# Altium project Nova_34.PrjPcb
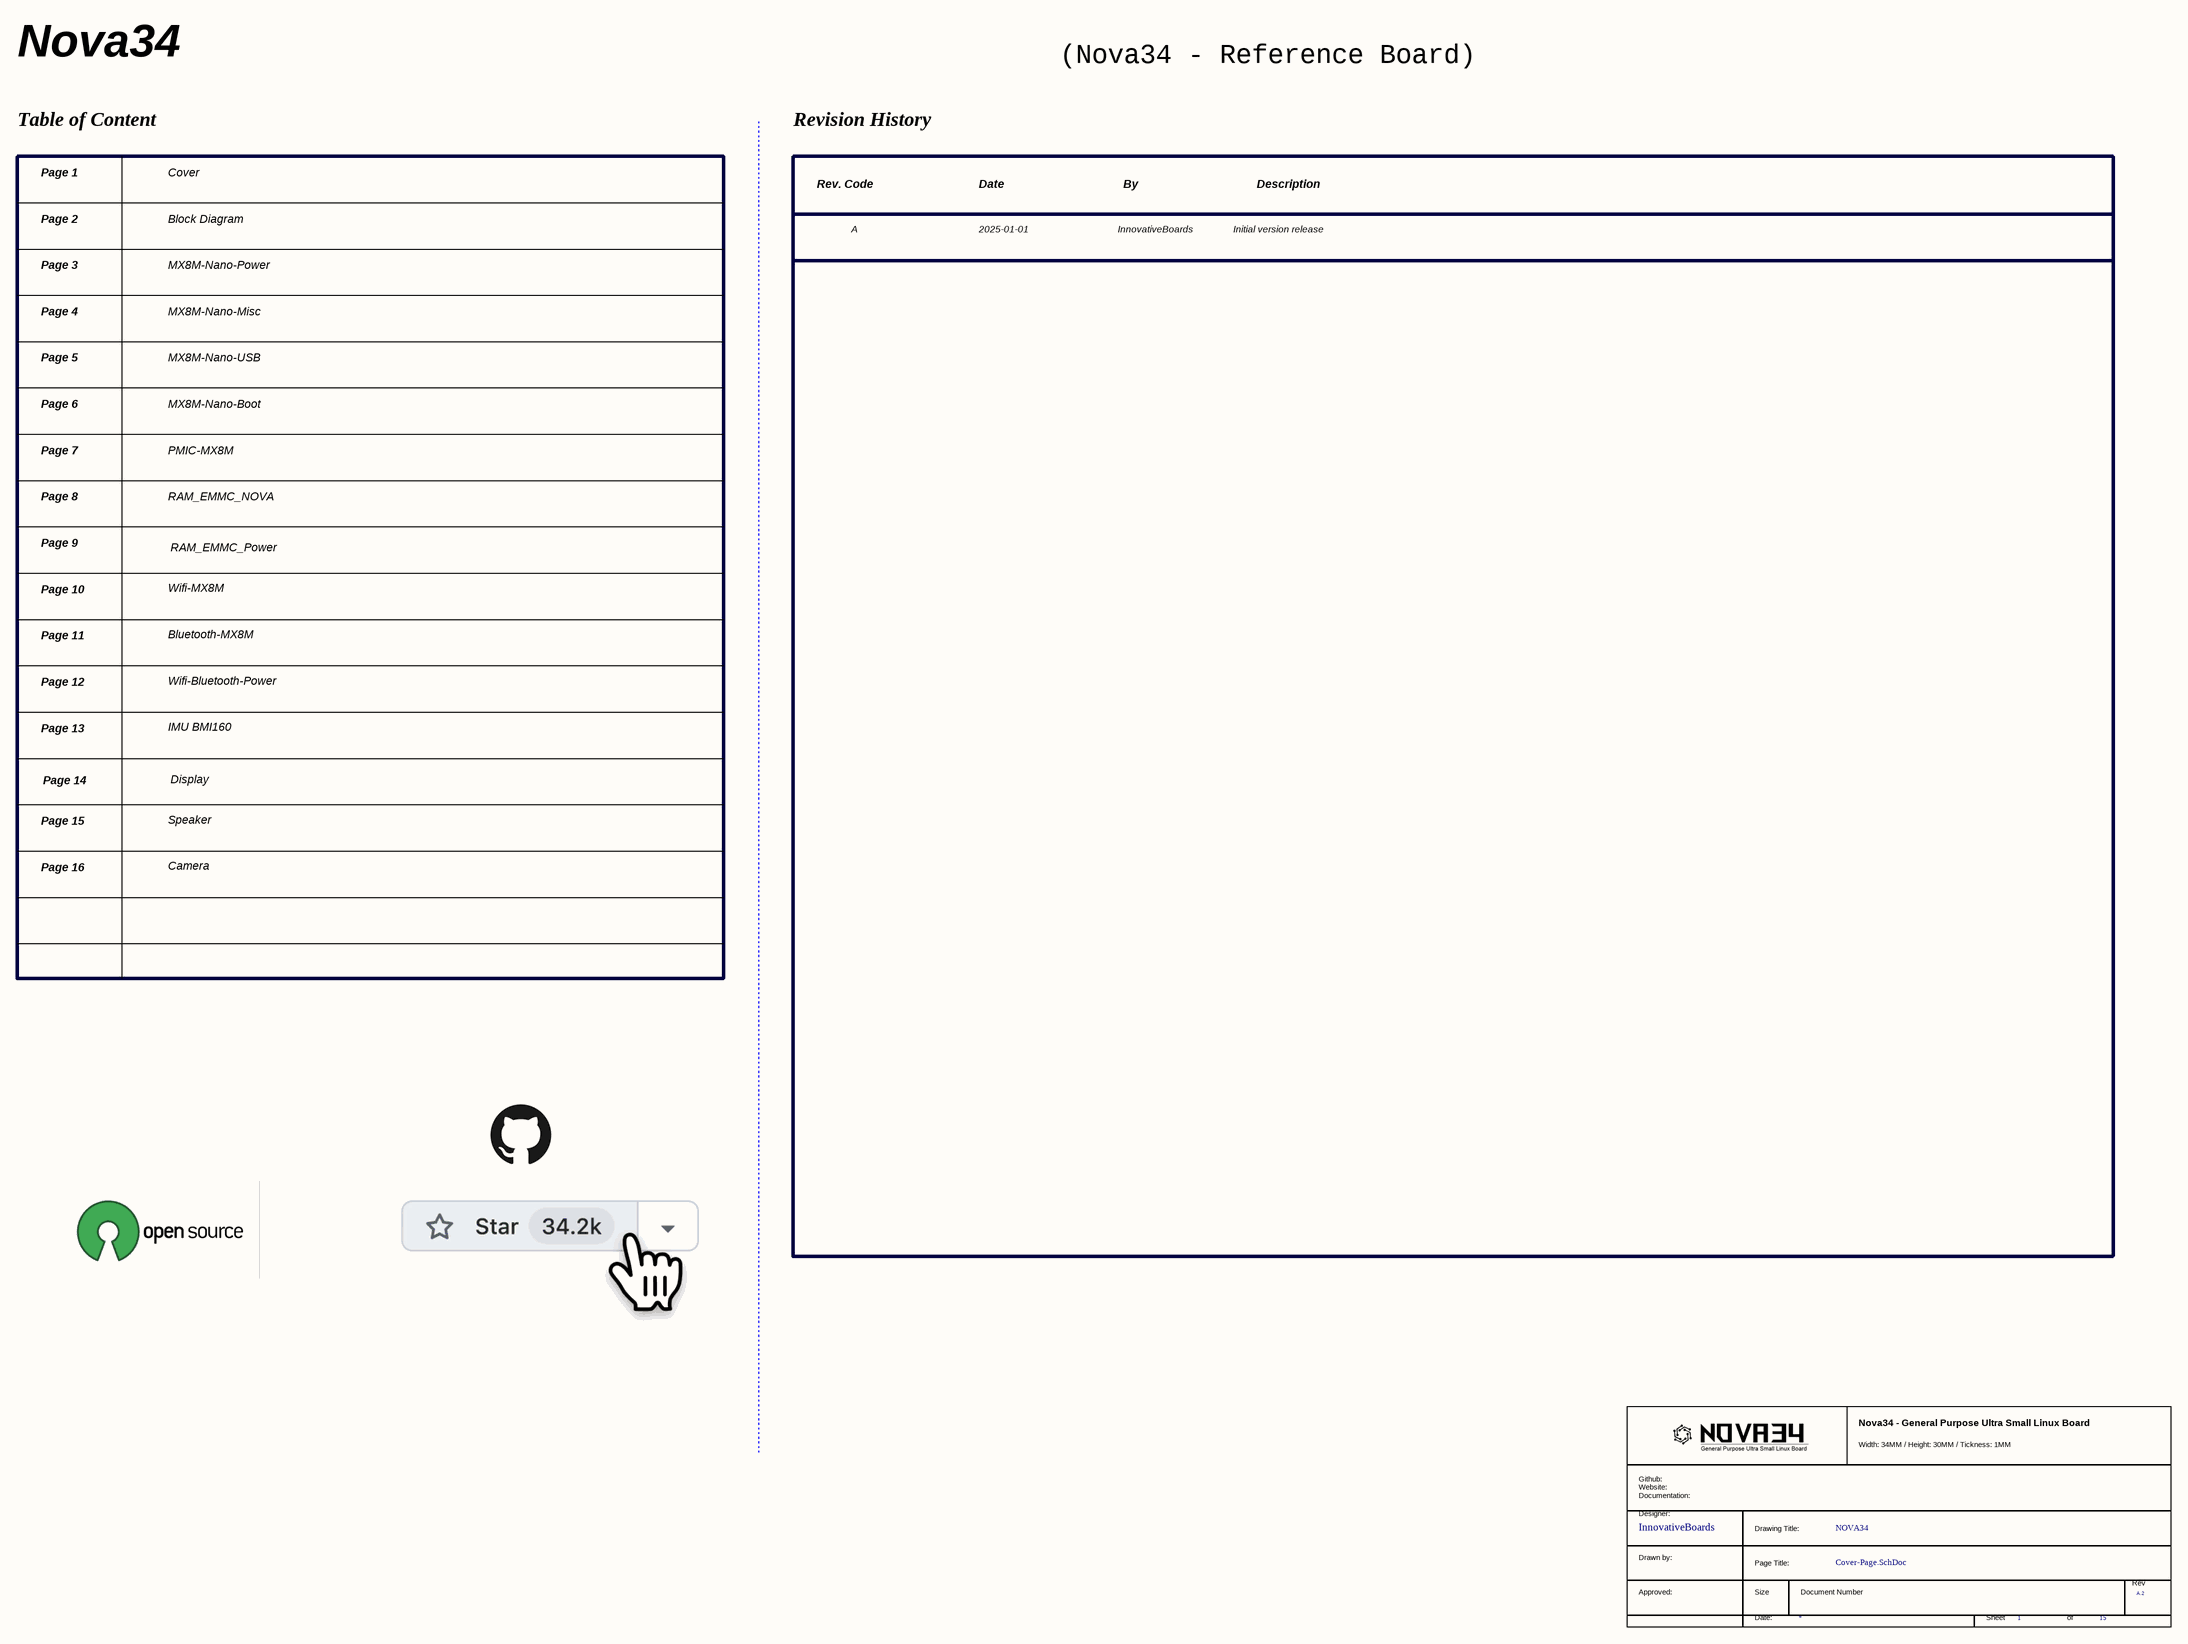
[diagram p0: Cover-Page.SchDoc]
8 sheets, 58 parts. Net scope: global (net labels, ports and power ports of the same name join across sheets).
Board file: Nova_PCB_Prod.PcbDoc
Sheets:
  Cover-Page.SchDoc
  NOVA-Block.SchDoc
    U_IMU-BMI160 = IMU-BMI160.SchDoc
    U_Display-ST0103A2W-WSNLW-F = Display-ST0103A2W-WSNLW-F.SchDoc
    U_Speaker = Speaker.SchDoc
    U_Bluetooth-MX8M = Bluetooth-MX8M.SchDoc
    U_Camera = Camera.SchDoc
    U_RAM_EMMC_Power = RAM_EMMC_Power.SchDoc

## Sheet Cover-Page.SchDoc
size C; SheetNumber: 1; SheetTotal: 15

### Parts
(Parts that share a designator on the sheet are numbered #1, #2 ... from top to bottom, then left to right.)
*#1  RevCode: A.2  (hidden comment: TitleBlock_MCPG)  (graphical)

### Notes on the sheet
- Nova34
- (Nova34 - Reference Board)
- Table of Content
- Page 1
- Cover
- Revision History
- Page 2
- Block Diagram
- Rev. Code
- A
- Date
- 2025-01-01
- InnovativeBoards
- By
- Initial version release
- Description
- Page 3
- MX8M-Nano-Power
- Page 4
- MX8M-Nano-Misc
- Page 5
- Page 6
- MX8M-Nano-USB
- MX8M-Nano-Boot
- Page 7
- PMIC-MX8M
- Page 8
- RAM_EMMC_NOVA
- Page 9
- RAM_EMMC_Power
- Page 10
- Page 11
- Wifi-MX8M
- Bluetooth-MX8M
- Page 12
- Wifi-Bluetooth-Power
- Page 13
- IMU BMI160
- Page 14
- Display
- Page 15
- Page 16
- Speaker
- Camera
- (in symbol TitleBlock_MCPG) Nova34 - General Purpose Ultra Small Linux Board; Width: 34MM / Height: 30MM / Tickness: 1MM; Github: / Website: / Documentation:; Designer:; InnovativeBoards; Drawing Title:; NOVA34; Drawn by:; Page Title:; Rev; Approved:; Size; Document Number; Date:; Sheet; of

### Library data of the parts
*#1 = TitleBlock_MCPG: Page Create Date: March  8, 1995

## Sheet NOVA-Block.SchDoc
size 406 x 355 mm; SheetNumber: 2; SheetTotal: 16
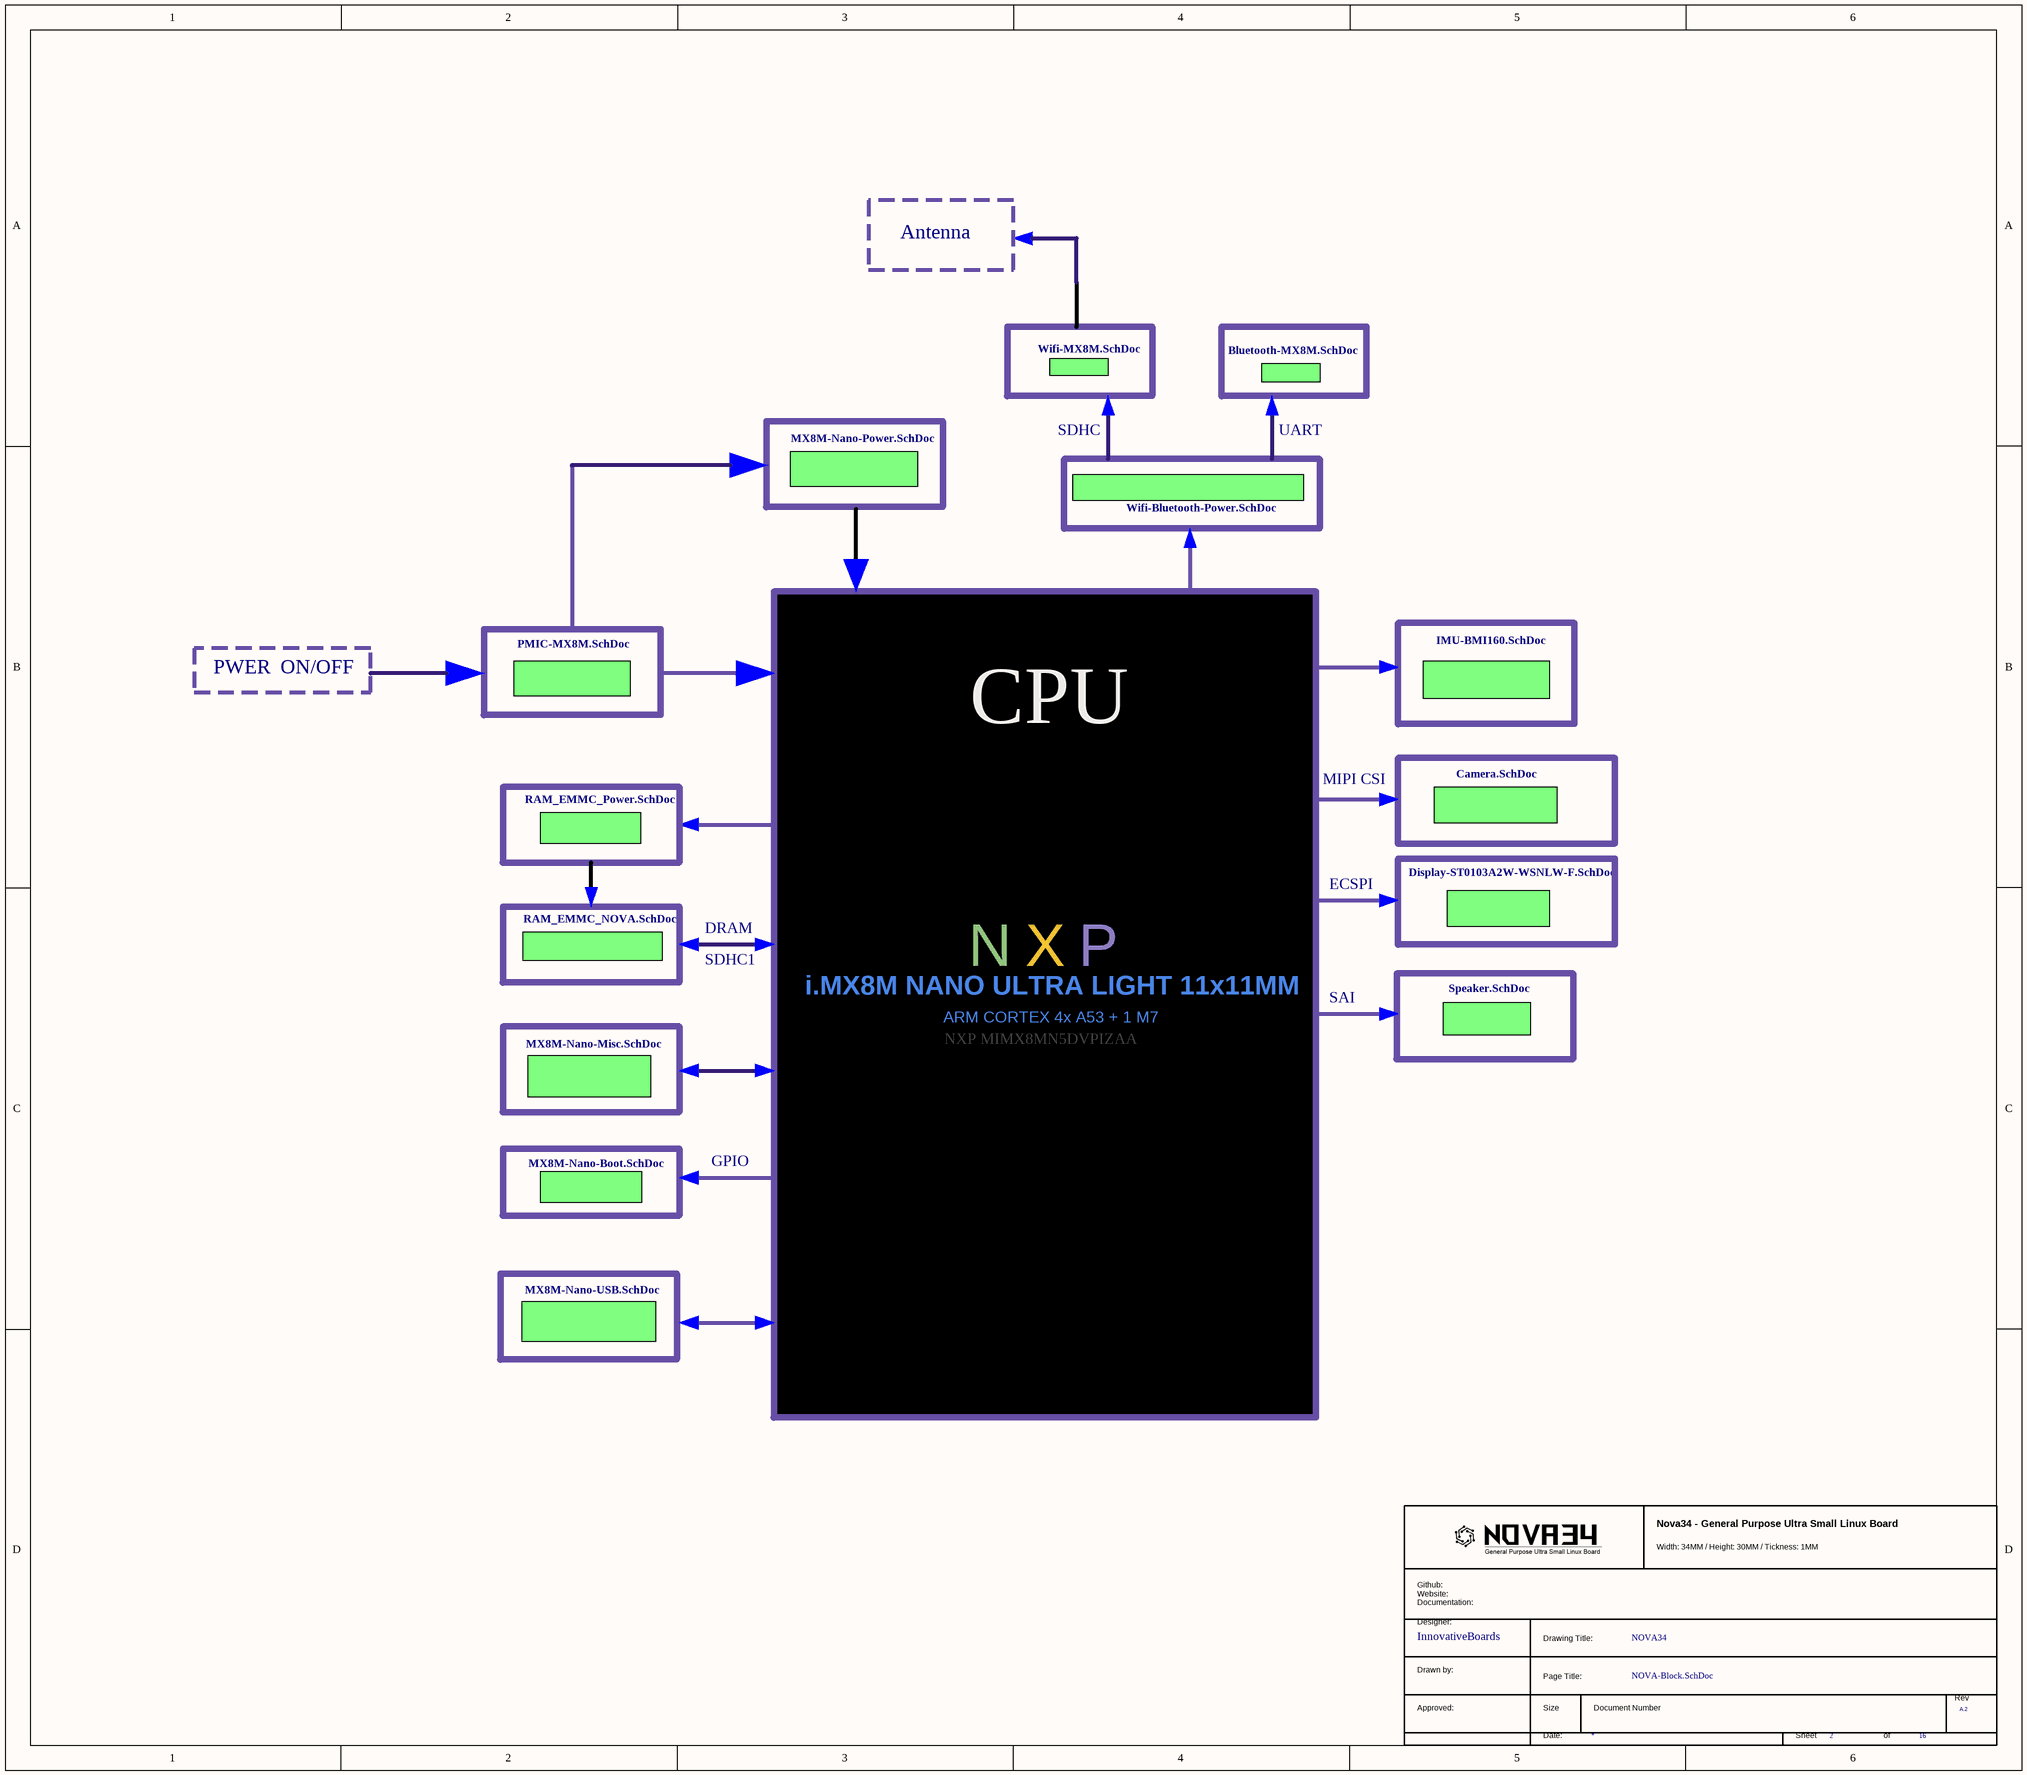
[diagram p1: NOVA-Block.SchDoc]

### Parts
(Parts that share a designator on the sheet are numbered #1, #2 ... from top to bottom, then left to right.)
*#2  RevCode: A.2  (hidden comment: TitleBlock_MCPG)  (graphical)

### Sub-sheets
U_Bluetooth-MX8M = Bluetooth-MX8M.SchDoc: no entries
U_Camera = Camera.SchDoc: no entries
U_Display-ST0103A2W-WSNLW-F = Display-ST0103A2W-WSNLW-F.SchDoc: no entries
U_IMU-BMI160 = IMU-BMI160.SchDoc: no entries
U_MX8M-Nano-Boot = MX8M-Nano-Boot.SchDoc (file not in this document): no entries
U_MX8M-Nano-Misc = MX8M-Nano-Misc.SchDoc (file not in this document): no entries
U_MX8M-Nano-Power = MX8M-Nano-Power.SchDoc (file not in this document): no entries
U_MX8M-Nano-USB = MX8M-Nano-USB.SchDoc (file not in this document): no entries
U_PMIC-MX8M = PMIC-MX8M.SchDoc (file not in this document): no entries
U_RAM_EMMC_NOVA = RAM_EMMC_NOVA.SchDoc (file not in this document): no entries
U_RAM_EMMC_Power = RAM_EMMC_Power.SchDoc: no entries
U_Speaker = Speaker.SchDoc: no entries
U_Wifi-Bluetooth-Power = Wifi-Bluetooth-Power.SchDoc (file not in this document): no entries
U_Wifi-MX8M = Wifi-MX8M.SchDoc (file not in this document): no entries

### Notes on the sheet
- Antenna
- SDHC
- UART
- PWER  ON/OFF
- CPU
- MIPI CSI
- ECSPI
- SDHC1
- DRAM
- N
- X
- P
- i.MX8M NANO ULTRA LIGHT 11x11MM
- ARM CORTEX 4x A53 + 1 M7
- SAI
- NXP MIMX8MN5DVPIZAA
- GPIO
- (in symbol TitleBlock_MCPG) Nova34 - General Purpose Ultra Small Linux Board; Width: 34MM / Height: 30MM / Tickness: 1MM; Github: / Website: / Documentation:; Designer:; InnovativeBoards; Drawing Title:; NOVA34; Drawn by:; Page Title:; Rev; Approved:; Size; Document Number; Date:; Sheet; of

### Library data of the parts
*#2 = TitleBlock_MCPG: Page Create Date: March  8, 1995

## Sheet IMU-BMI160.SchDoc
size A; SheetNumber: 12; SheetTotal: 15
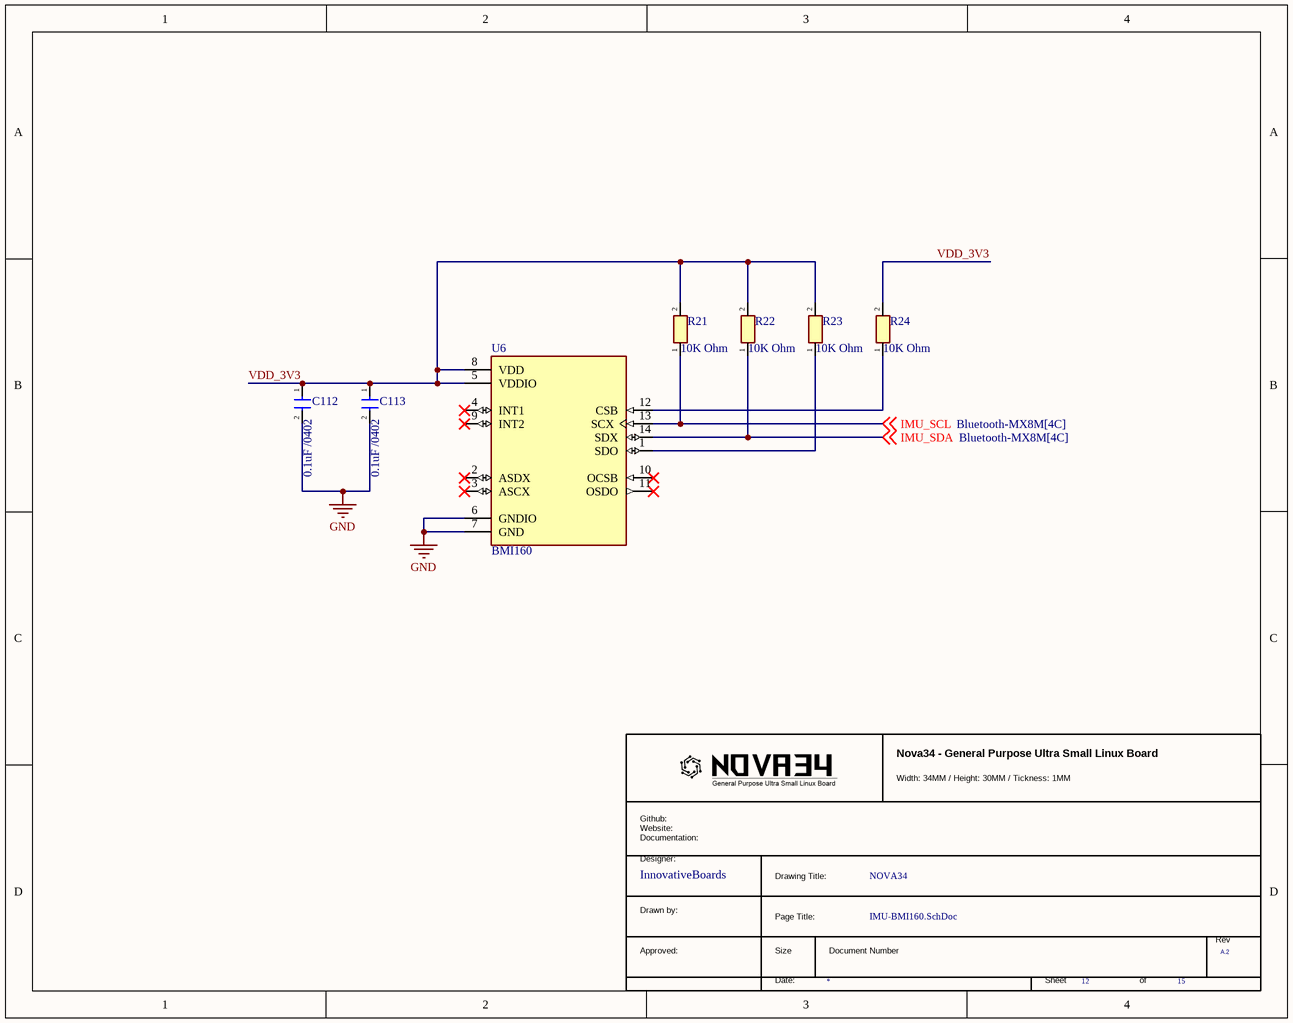
[diagram p2: IMU-BMI160.SchDoc]

### Parts
(Parts that share a designator on the sheet are numbered #1, #2 ... from top to bottom, then left to right.)
*#3  RevCode: A.2  (hidden comment: TitleBlock_MCPG)  (graphical)
C112  0.1uF /0402  [CAPC1005X70N]
C113  0.1uF /0402  [CAPC1005X70N]
R21  10K Ohm  [RESC1005X40N]
R22  10K Ohm  [RESC1005X40N]
R23  10K Ohm  [RESC1005X40N]
R24  10K Ohm  [RESC1005X40N]
U6  BMI160  [PQFN50P250X300X88-14N]

### Nets
GND: C112.2 C113.2 U6.6(GNDIO) U6.7(GND)
IMU_SCL: R21.1 U6.13(SCX) ; off-sheet IMU_SCL
IMU_SDA: R22.1 U6.14(SDX) ; off-sheet IMU_SDA
VDD_3V3: C112.1 C113.1 R21.2 R22.2 R23.2 R24.2 U6.5(VDDIO) U6.8(VDD)
NetR23_1: R23.1 U6.1(SDO)
NetR24_1: R24.1 U6.12(CSB)

Not connected (* = marked no-connect by the designer): U6 2(ASDX)* 3(ASCX)* 4(INT1)* 9(INT2)* 10(OCSB)* 11(OSDO)*

### Notes on the sheet
- (in symbol TitleBlock_MCPG) Nova34 - General Purpose Ultra Small Linux Board; Width: 34MM / Height: 30MM / Tickness: 1MM; Github: / Website: / Documentation:; Designer:; InnovativeBoards; Drawing Title:; NOVA34; Drawn by:; Page Title:; Rev; Approved:; Size; Document Number; Date:; Sheet; of

### Library data of the parts
C112 C113 = GRM155R71C104KA88D: Capacitor; Manufacturer_Name: Murata Electronics; Datasheet Link: https://search.murata.co.jp/Ceramy/image/img/A01X/G101/ENG/GRM155R71C104KA88-01A.pdf; Height: 0.7mm; Manufacturer_Part_Number: GRM155R71C104KA88D; Mouser Part Number: N/A; Arrow Part Number: GRM155R71C104KA88D; Arrow Price/Stock: https://www.arrow.com/en/products/grm155r71c104ka88d/murata-manufacturing?utm_currency=USD&region=nac
R21-R24 = RC0402FR-0710KL: Resistor; Manufacturer_Name: KEMET; Datasheet Link: http://www.yageo.com/documents/recent/PYu-RC0402_51_RoHS_L_6_r.pdf; Height: 0.4mm; Manufacturer_Part_Number: RC0402FR-0710KL; Mouser Part Number: 603-RC0402FR-0710KL; Mouser Price/Stock: https://www.mouser.co.uk/ProductDetail/YAGEO/RC0402FR-0710KL?qs=I1mnnYJTTsxUoNwrUsQExA%3D%3D; Arrow Part Number: RC0402FR-0710KL; Arrow Price/Stock: https://www.arrow.com/en/products/rc0402fr-0710kl/yageo?region=europe
U6 = BMI160: Accelerometer, Gyroscope, 6 Axis Sensor IÂ²C, SPI Output; Package: None; Price: None; Availability: Unavailable; MP: BMI160; Value: *
*#3 = TitleBlock_MCPG: Page Create Date: March  8, 1995

## Sheet Display-ST0103A2W-WSNLW-F.SchDoc
size B; SheetNumber: 14; SheetTotal: 15
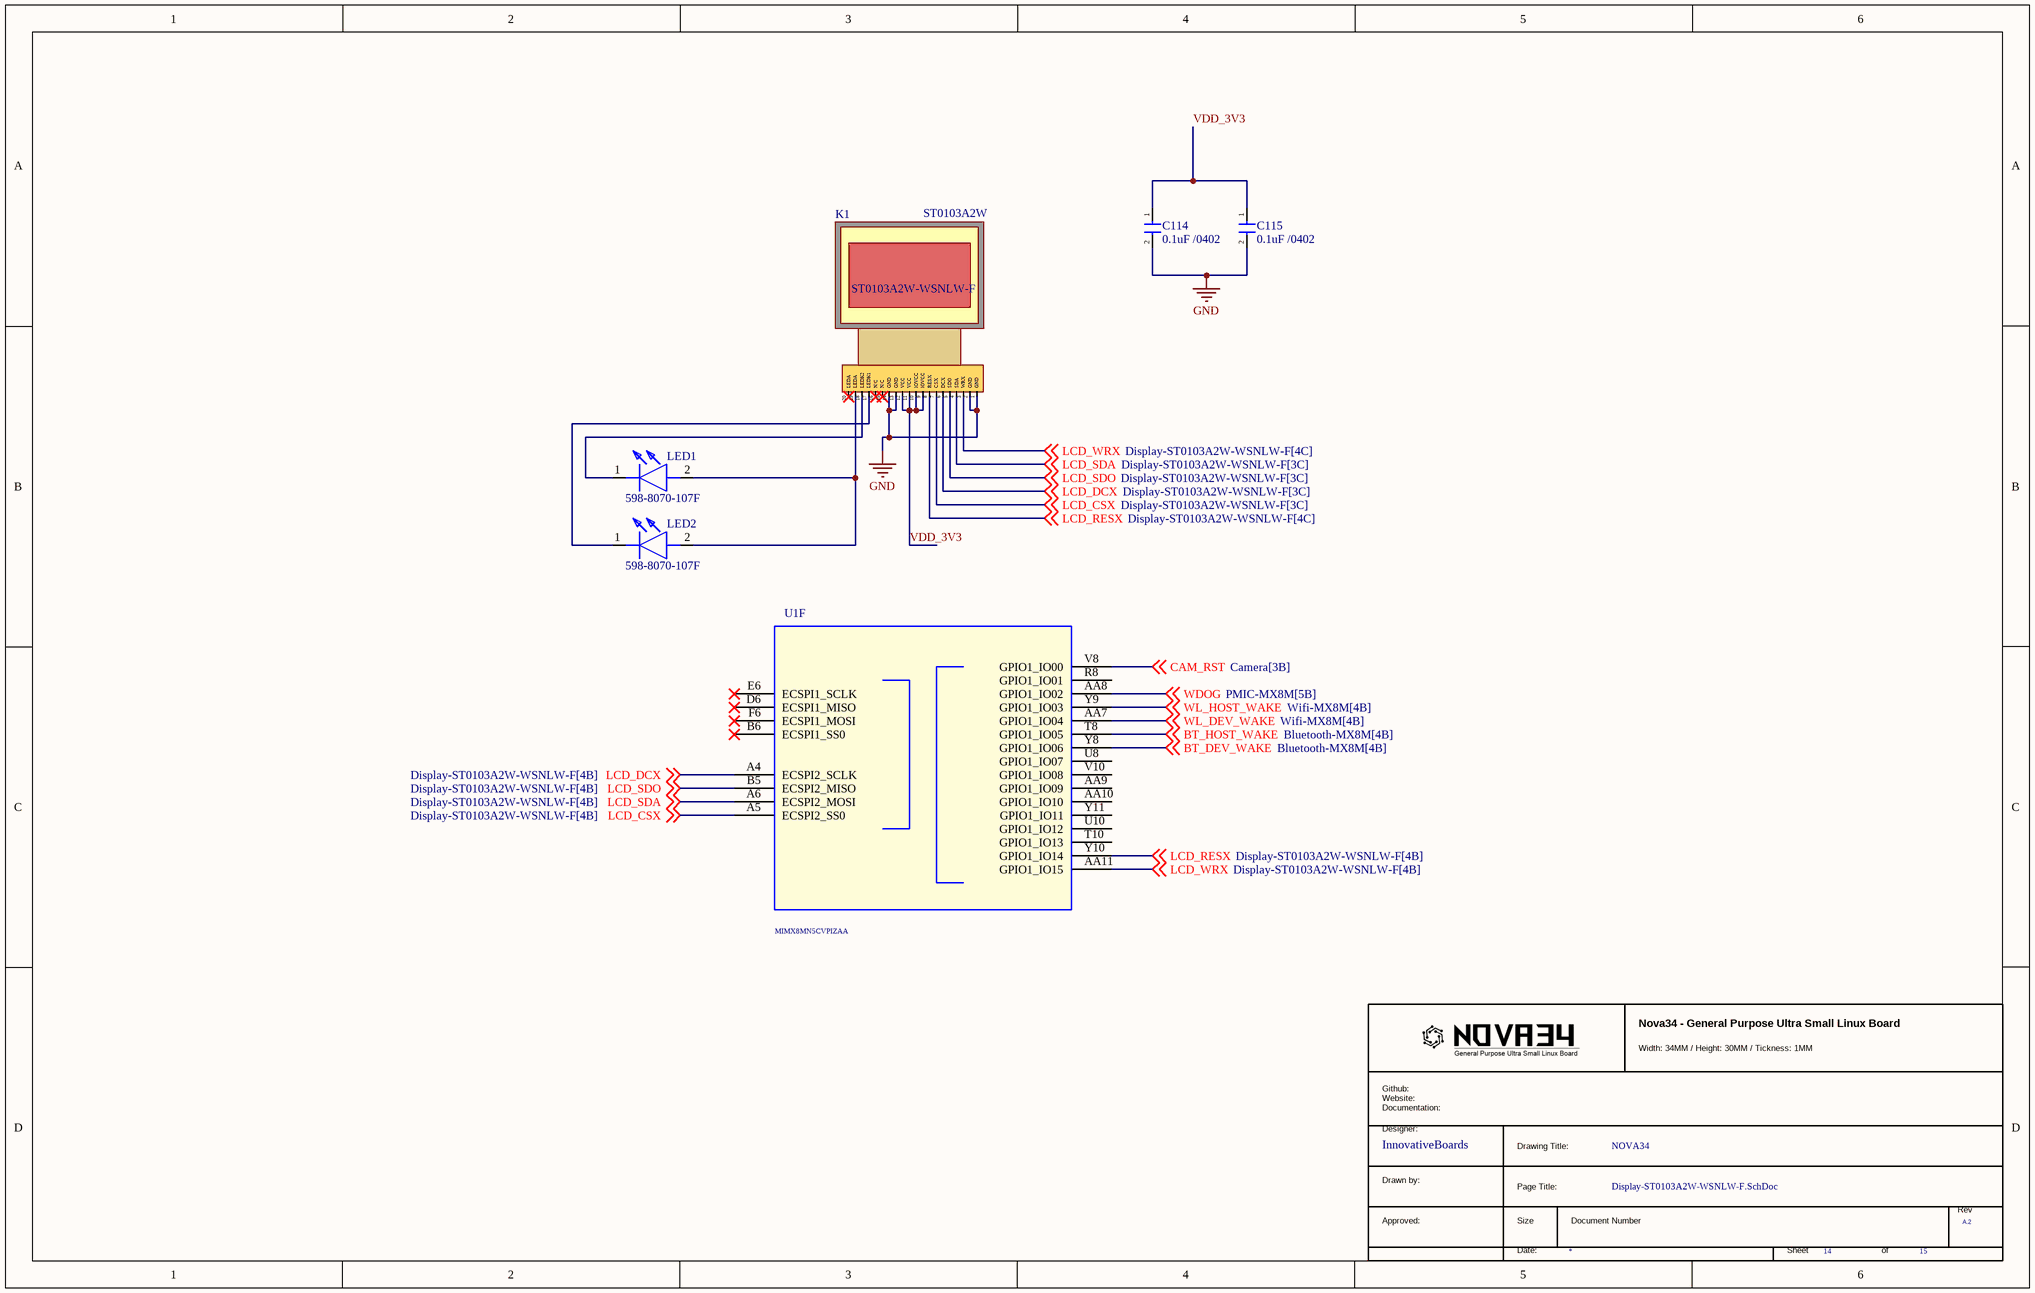
[diagram p3: Display-ST0103A2W-WSNLW-F.SchDoc]

### Parts
(Parts that share a designator on the sheet are numbered #1, #2 ... from top to bottom, then left to right.)
*#4  RevCode: A.2  (hidden comment: TitleBlock_MCPG)  (graphical)
C114  0.1uF /0402  [CAPC1005X70N]
C115  0.1uF /0402  [CAPC1005X70N]
K1  ST0103A2W  [Display]
LED1  598-8070-107F  [5988070107F]
LED2  598-8070-107F  [5988070107F]
U1  MIMX8MN5CVPIZAA  [BGA306C50P21X21_1100X1100X101]  (part F of 12)

### Nets
GND: C114.2 C115.2 K1.1(GND) K1.2(GND) K1.13(GND) K1.14(GND)
BT_DEV_WAKE: U1.Y8(GPIO1_IO06) ; off-sheet BT_DEV_WAKE
BT_HOST_WAKE: U1.T8(GPIO1_IO05) ; off-sheet BT_HOST_WAKE
CAM_RST: U1.V8(GPIO1_IO00) ; off-sheet CAM_RST
LCD_CSX: K1.7(CSX) U1.A5(ECSPI2_SS0) ; off-sheet LCD_CSX
LCD_DCX: K1.6(DCX) U1.A4(ECSPI2_SCLK) ; off-sheet LCD_DCX
LCD_RESX: K1.8(RESX) U1.Y10(GPIO1_IO14) ; off-sheet LCD_RESX
LCD_SDA: K1.4(SDA) U1.A6(ECSPI2_MOSI) ; off-sheet LCD_SDA
LCD_SDO: K1.5(SDO) U1.B5(ECSPI2_MISO) ; off-sheet LCD_SDO
LCD_WRX: K1.3(WRX) U1.AA11(GPIO1_IO15) ; off-sheet LCD_WRX
VDD_3V3: C114.1 C115.1 K1.9(lOVCC) K1.10(lOVCC) K1.11(VCC) K1.12(VCC)
WDOG: U1.AA8(GPIO1_IO02) ; off-sheet WDOG
WL_DEV_WAKE: U1.AA7(GPIO1_IO04) ; off-sheet WL_DEV_WAKE
WL_HOST_WAKE: U1.Y9(GPIO1_IO03) ; off-sheet WL_HOST_WAKE
NetK1_17: K1.17(LEDK1) LED2.1(K)
NetK1_18: K1.18(LEDK2) LED1.1(K)
NetK1_19: K1.19(LEDA) LED1.2(A) LED2.2(A)

Not connected (* = marked no-connect by the designer): K1 15(N/C)* 16(N/C)* 20(LEDA)*; U1 AA9(GPIO1_IO09) AA10(GPIO1_IO10) B6(ECSPI1_SS0)* D6(ECSPI1_MISO)* E6(ECSPI1_SCLK)* F6(ECSPI1_MOSI)* R8(GPIO1_IO01) T10(GPIO1_IO13) U8(GPIO1_IO07) U10(GPIO1_IO12) V10(GPIO1_IO08) Y11(GPIO1_IO11)

### Notes on the sheet
- (in symbol ST0103A2W) ST0103A2W-WSNLW-F
- (in symbol TitleBlock_MCPG) Nova34 - General Purpose Ultra Small Linux Board; Width: 34MM / Height: 30MM / Tickness: 1MM; Github: / Website: / Documentation:; Designer:; InnovativeBoards; Drawing Title:; NOVA34; Drawn by:; Page Title:; Rev; Approved:; Size; Document Number; Date:; Sheet; of

### Library data of the parts
C114 C115 = GRM155R71C104KA88D: as C112 on sheet IMU-BMI160; Datasheet Link: https://search.murata.co.jp/Ceramy/image/img/A01X/G101/ENG/GRM155R71C104KA88-01A.pdf; Height: 0.7mm; Manufacturer_Part_Number: GRM155R71C104KA88D; Mouser Part Number: N/A; Arrow Part Number: GRM155R71C104KA88D; Arrow Price/Stock: https://www.arrow.com/en/products/grm155r71c104ka88d/murata-manufacturing?utm_currency=USD&region=nac
LED1 LED2 = 598-8070-107F: LED; Manufacturer_Name: Dialight; Datasheet Link: https://www.mouser.in/datasheet/2/109/Dialight_CBI_data_598_0603_Apr2018-2944350.pdf; Height: 0.8mm; Manufacturer_Part_Number: 598-8070-107F; Mouser Part Number: 645-598-8070-107F; Mouser Price/Stock: https://www.mouser.co.uk/ProductDetail/Dialight/598-8070-107F?qs=7JStj%2FjQ2SEP6f6GzqcocA%3D%3D; Arrow Part Number: 598-8070-107F; Arrow Price/Stock: https://www.arrow.com/en/products/598-8070-107f/dialight?region=nac
U1 = MIMX8MN: IC CPU QUAD CORTEX A53+M7 1.4GHZ -- BGA306; PCB Footprint: pbga306_0p5_sq11mm; AGILE_PN: TMP-CIP-5098; CAD_APPROVED: Yes; PRE_APN: 330-77152; Temp Range: -40¡ãC to 105¡ãC; MFG_NAME01: NXP SEMICONDUCTORS; CLASS: IC; HEIGHT: 1.01MM; ROHS: Yes; MFG_PN01: MIMX8MN5CVPIZAA
*#4 = TitleBlock_MCPG: Page Create Date: March  8, 1995

## Sheet Speaker.SchDoc
size A; SheetNumber: 14; SheetTotal: 15
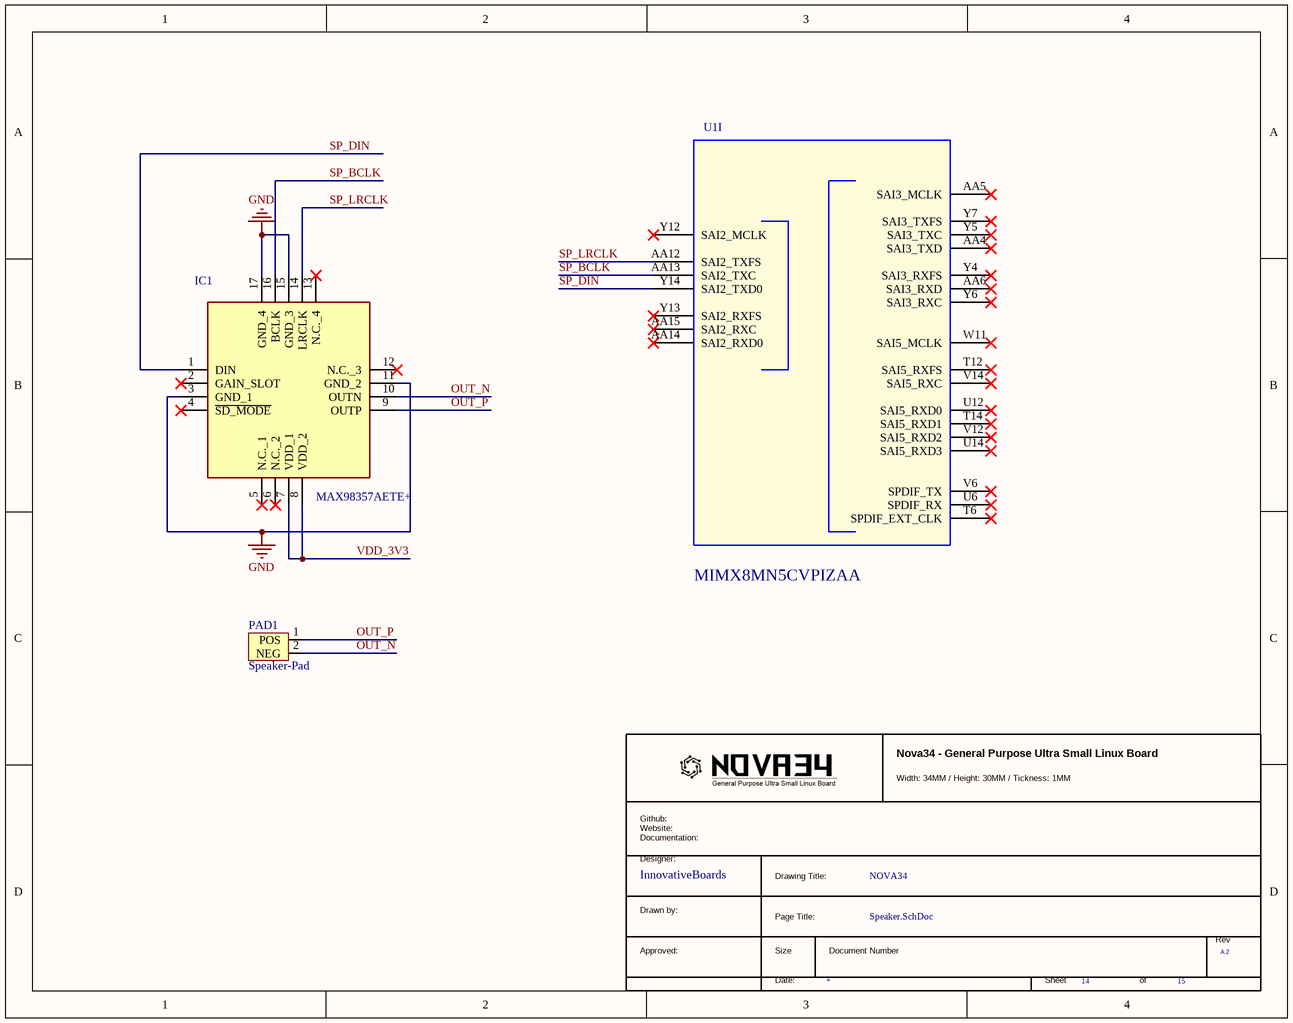
[diagram p4: Speaker.SchDoc]

### Parts
(Parts that share a designator on the sheet are numbered #1, #2 ... from top to bottom, then left to right.)
*#5  RevCode: A.2  (hidden comment: TitleBlock_MCPG)  (graphical)
IC1  MAX98357AETE+  [QFN50P300X300X80-17N]
PAD1  Speaker-Pad  [Speaker-Pad]
U1  MIMX8MN5CVPIZAA  [BGA306C50P21X21_1100X1100X101]  (part I of 12)

### Nets
GND: IC1.3(GND_1) IC1.11(GND_2) IC1.15(GND_3) IC1.17(GND_4)
OUT_N: IC1.10(OUTN) PAD1.2(NEG)
OUT_P: IC1.9(OUTP) PAD1.1(POS)
SP_BCLK: IC1.16(BCLK) U1.AA13(SAI2_TXC)
SP_DIN: IC1.1(DIN) U1.Y14(SAI2_TXD0)
SP_LRCLK: IC1.14(LRCLK) U1.AA12(SAI2_TXFS)
VDD_3V3: IC1.7(VDD_1) IC1.8(VDD_2)

Not connected (* = marked no-connect by the designer): IC1 2(GAIN_SLOT)* 4(~{SD_MODE})* 5(N.C._1)* 6(N.C._2)* 12(N.C._3)* 13(N.C._4)*; U1 AA4(SAI3_TXD)* AA5(SAI3_MCLK)* AA6(SAI3_RXD)* AA14(SAI2_RXD0)* AA15(SAI2_RXC)* T6(SPDIF_EXT_CLK)* T12(SAI5_RXFS)* T14(SAI5_RXD1)* U6(SPDIF_RX)* U12(SAI5_RXD0)* U14(SAI5_RXD3)* V6(SPDIF_TX)* V12(SAI5_RXD2)* V14(SAI5_RXC)* W11(SAI5_MCLK)* Y4(SAI3_RXFS)* Y5(SAI3_TXC)* Y6(SAI3_RXC)* Y7(SAI3_TXFS)* Y12(SAI2_MCLK)* Y13(SAI2_RXFS)*

### Notes on the sheet
- (in symbol TitleBlock_MCPG) Nova34 - General Purpose Ultra Small Linux Board; Width: 34MM / Height: 30MM / Tickness: 1MM; Github: / Website: / Documentation:; Designer:; InnovativeBoards; Drawing Title:; NOVA34; Drawn by:; Page Title:; Rev; Approved:; Size; Document Number; Date:; Sheet; of

### Library data of the parts
IC1 = MAX98357AETE+: Integrated Circuit; Manufacturer_Name: Analog Devices; Datasheet Link: https://datasheets.maximintegrated.com/en/ds/MAX98357A-MAX98357B.pdf; Height: 0.8mm; Manufacturer_Part_Number: MAX98357AETE+; Mouser Part Number: 700-MAX98357AETE+; Mouser Price/Stock: https://www.mouser.co.uk/ProductDetail/Analog-Devices-Maxim-Integrated/MAX98357AETE%2b?qs=AAveGqk956EyS6m3AmZeuw%3D%3D
U1 = MIMX8MN: as U1 on sheet Display-ST0103A2W-WSNLW-F; CLASS: IC; HEIGHT: 1.01MM; ROHS: Yes; MFG_PN01: MIMX8MN5CVPIZAA
*#5 = TitleBlock_MCPG: Page Create Date: March  8, 1995

## Sheet Bluetooth-MX8M.SchDoc
size B; SheetNumber: 10; SheetTotal: 15
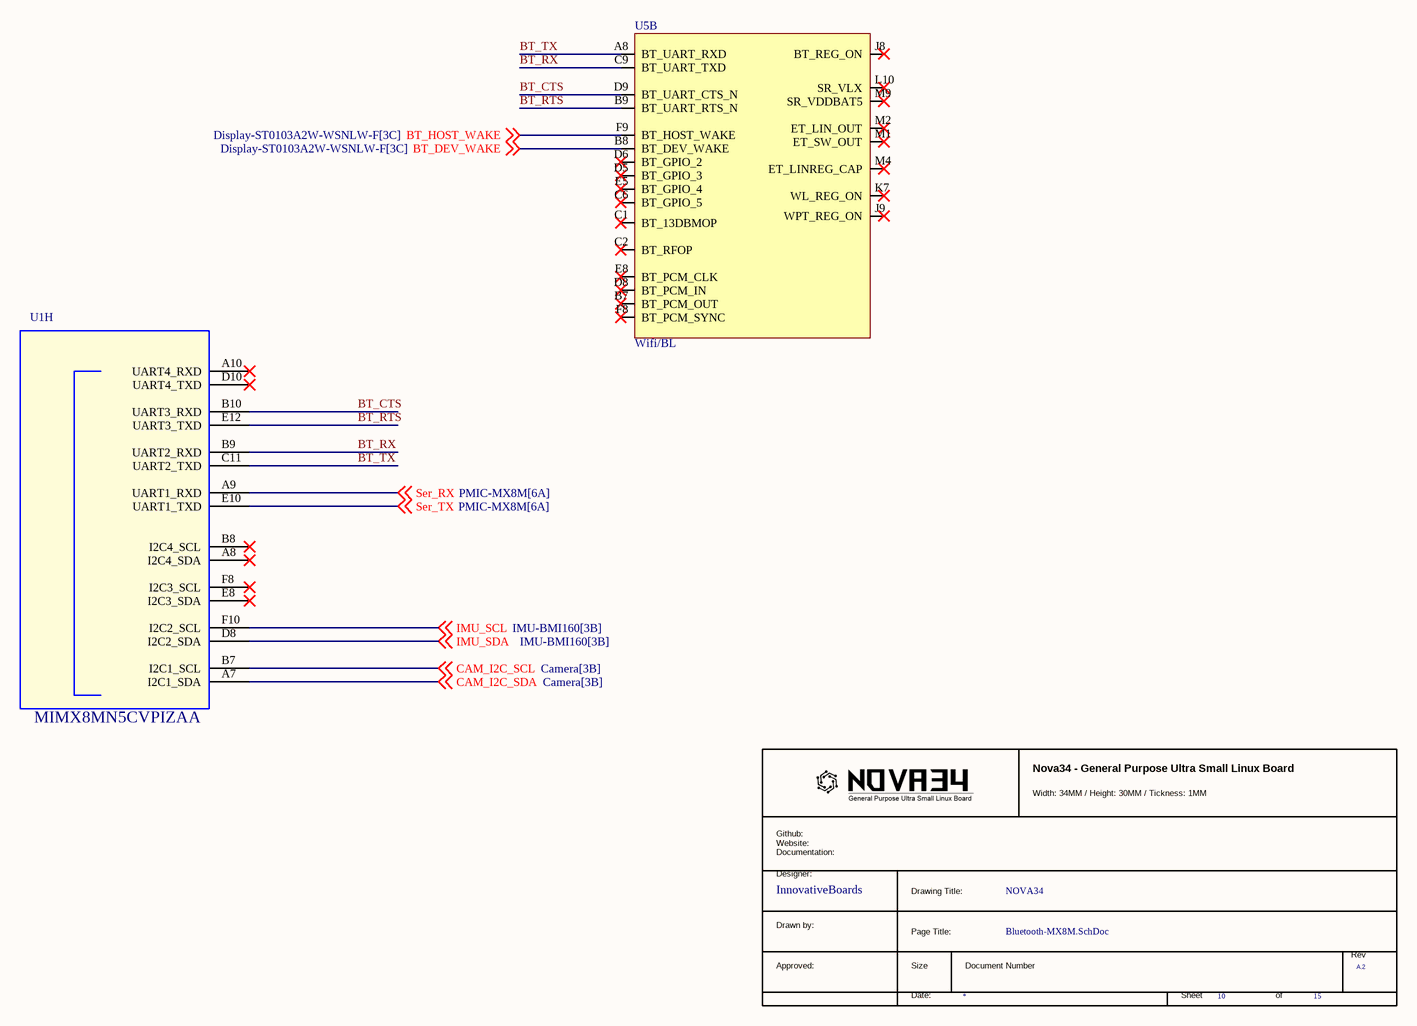
[diagram p5: Bluetooth-MX8M.SchDoc]

### Parts
(Parts that share a designator on the sheet are numbered #1, #2 ... from top to bottom, then left to right.)
*#6  RevCode: A.2  (hidden comment: TitleBlock_MCPG)  (graphical)
U1  MIMX8MN5CVPIZAA  [BGA306C50P21X21_1100X1100X101]  (part H of 12)
U5  Wifi/BL  [106 BALL WLBGA 3.76X4.43X0.53 MM]  (part B of 3)

### Nets
BT_CTS: U1.B10(UART3_RXD) U5.D9(BT_UART_CTS_N)
BT_DEV_WAKE: U5.B8(BT_DEV_WAKE) ; off-sheet BT_DEV_WAKE
BT_HOST_WAKE: U5.F9(BT_HOST_WAKE) ; off-sheet BT_HOST_WAKE
BT_RTS: U1.E12(UART3_TXD) U5.B9(BT_UART_RTS_N)
BT_RX: U1.B9(UART2_RXD) U5.C9(BT_UART_TXD)
BT_TX: U1.C11(UART2_TXD) U5.A8(BT_UART_RXD)
CAM_I2C_SCL: U1.B7(I2C1_SCL) ; off-sheet CAM_I2C_SCL
CAM_I2C_SDA: U1.A7(I2C1_SDA) ; off-sheet CAM_I2C_SDA
IMU_SCL: U1.F10(I2C2_SCL) ; off-sheet IMU_SCL
IMU_SDA: U1.D8(I2C2_SDA) ; off-sheet IMU_SDA
Ser_RX: U1.A9(UART1_RXD) ; off-sheet Ser_RX
Ser_TX: U1.E10(UART1_TXD) ; off-sheet Ser_TX

Not connected (* = marked no-connect by the designer): U1 A8(I2C4_SDA)* A10(UART4_RXD)* B8(I2C4_SCL)* D10(UART4_TXD)* E8(I2C3_SDA)* F8(I2C3_SCL)*; U5 B7(BT_PCM_OUT)* C1(BT_13DBMOP)* C2(BT_RFOP)* C6(BT_GPIO_5)* D5(BT_GPIO_3)* D6(BT_GPIO_2)* D8(BT_PCM_IN)* E5(BT_GPIO_4)* E8(BT_PCM_CLK)* F8(BT_PCM_SYNC)* J8(BT_REG_ON)* J9(WPT_REG_ON)* K7(WL_REG_ON)* L10(SR_VLX)* M1(ET_SW_OUT)* M2(ET_LIN_OUT)* M4(ET_LINREG_CAP)* M9(SR_VDDBAT5)*

### Notes on the sheet
- (in symbol TitleBlock_MCPG) Nova34 - General Purpose Ultra Small Linux Board; Width: 34MM / Height: 30MM / Tickness: 1MM; Github: / Website: / Documentation:; Designer:; InnovativeBoards; Drawing Title:; NOVA34; Drawn by:; Page Title:; Rev; Approved:; Size; Document Number; Date:; Sheet; of

### Library data of the parts
U1 = MIMX8MN: as U1 on sheet Display-ST0103A2W-WSNLW-F; CLASS: IC; HEIGHT: 1.01MM; ROHS: Yes; MFG_PN01: MIMX8MN5CVPIZAA
U5 = CYW43012
*#6 = TitleBlock_MCPG: Page Create Date: March  8, 1995

## Sheet Camera.SchDoc
size A; SheetNumber: 16; SheetTotal: 15
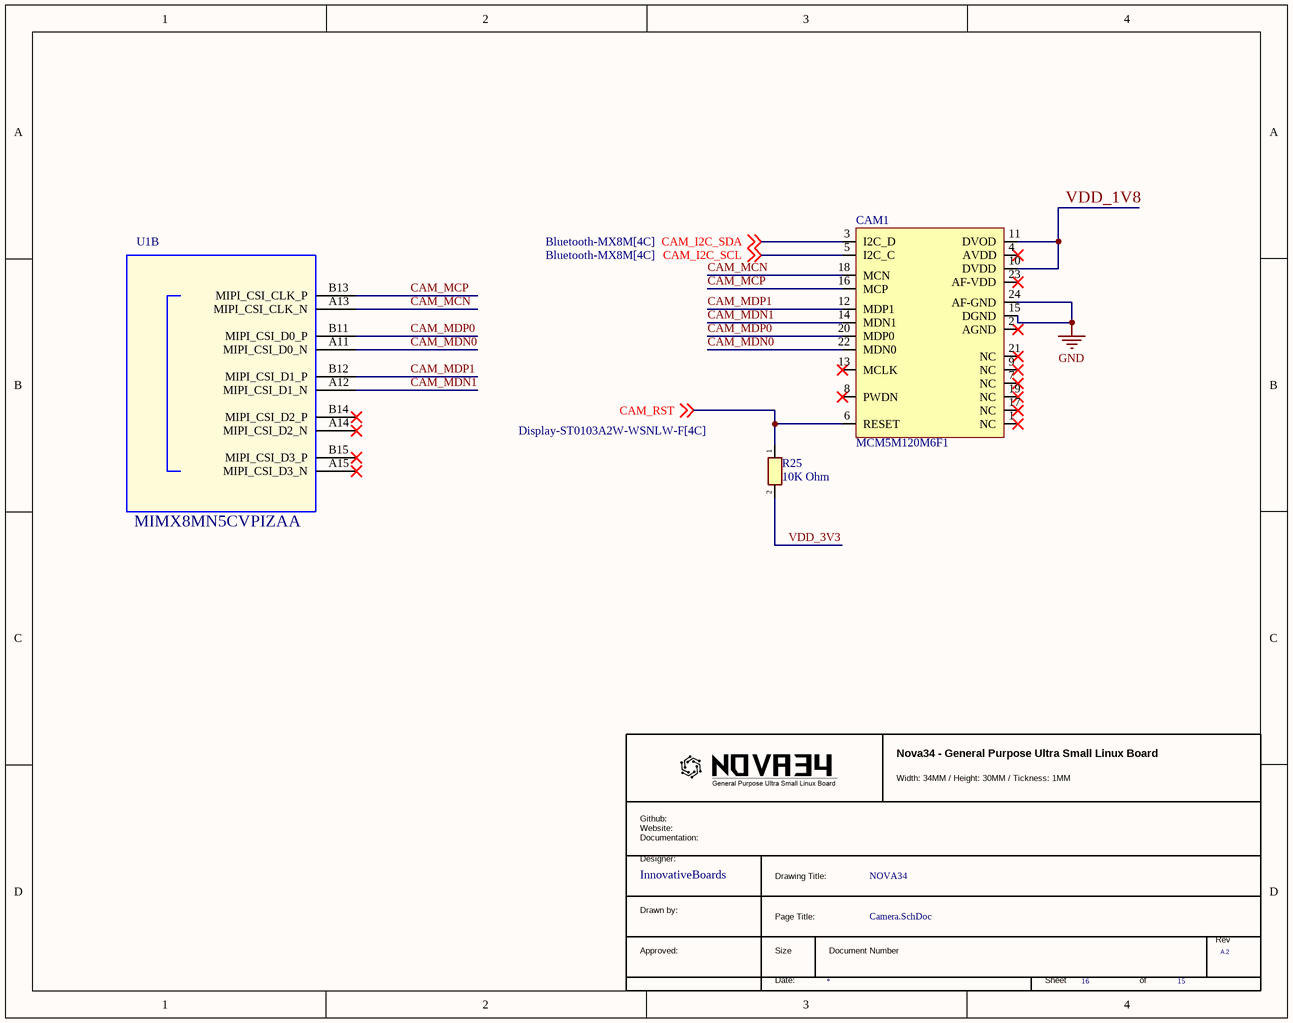
[diagram p6: Camera.SchDoc]

### Parts
(Parts that share a designator on the sheet are numbered #1, #2 ... from top to bottom, then left to right.)
*#7  RevCode: A.2  (hidden comment: TitleBlock_MCPG)  (graphical)
CAM1  MCM5M120M6F1  [MCM5M120M6F1]
R25  10K Ohm  [RESC1005X40N]
U1  MIMX8MN5CVPIZAA  [BGA306C50P21X21_1100X1100X101]  (part B of 12)

### Nets
GND: CAM1.15(DGND) CAM1.24(AF-GND)
CAM_I2C_SCL: CAM1.5(I2C_C) ; off-sheet CAM_I2C_SCL
CAM_I2C_SDA: CAM1.3(I2C_D) ; off-sheet CAM_I2C_SDA
CAM_MCN: CAM1.18(MCN) U1.A13(MIPI_CSI_CLK_N)
CAM_MCP: CAM1.16(MCP) U1.B13(MIPI_CSI_CLK_P)
CAM_MDN0: CAM1.22(MDN0) U1.A11(MIPI_CSI_D0_N)
CAM_MDN1: CAM1.14(MDN1) U1.A12(MIPI_CSI_D1_N)
CAM_MDP0: CAM1.20(MDP0) U1.B11(MIPI_CSI_D0_P)
CAM_MDP1: CAM1.12(MDP1) U1.B12(MIPI_CSI_D1_P)
CAM_RST: CAM1.6(RESET) R25.1 ; off-sheet CAM_RST
VDD_1V8: CAM1.10(DVDD) CAM1.11(DVOD)
VDD_3V3: R25.2

Not connected (* = marked no-connect by the designer): CAM1 1(NC)* 2(AGND)* 4(AVDD)* 7(NC)* 8(PWDN)* 9(NC)* 13(MCLK)* 17(NC)* 19(NC)* 21(NC)* 23(AF-VDD)*; U1 A14(MIPI_CSI_D2_N)* A15(MIPI_CSI_D3_N)* B14(MIPI_CSI_D2_P)* B15(MIPI_CSI_D3_P)*

### Notes on the sheet
- (in symbol TitleBlock_MCPG) Nova34 - General Purpose Ultra Small Linux Board; Width: 34MM / Height: 30MM / Tickness: 1MM; Github: / Website: / Documentation:; Designer:; InnovativeBoards; Drawing Title:; NOVA34; Drawn by:; Page Title:; Rev; Approved:; Size; Document Number; Date:; Sheet; of

### Library data of the parts
CAM1 = MCM5M120M6F1: MCM5M120M6F1 is a cost effective 5 Mega Pixel MIPI camera module with an M6 lens slot.; ComponentLink1Description: New link; ComponentLink1URL: https://iadiy.com/MIPI-CAMERA-MODULE?product_id=641
R25 = RC0402FR-0710KL: Resistor; Manufacturer_Name: KEMET; Datasheet Link: http://www.yageo.com/documents/recent/PYu-RC0402_51_RoHS_L_6_r.pdf; Height: 0.4mm; Manufacturer_Part_Number: RC0402FR-0710KL; Mouser Part Number: 603-RC0402FR-0710KL; Mouser Price/Stock: https://www.mouser.co.uk/ProductDetail/YAGEO/RC0402FR-0710KL?qs=I1mnnYJTTsxUoNwrUsQExA%3D%3D; Arrow Part Number: RC0402FR-0710KL; Arrow Price/Stock: https://www.arrow.com/en/products/rc0402fr-0710kl/yageo?region=europe
U1 = MIMX8MN: as U1 on sheet Display-ST0103A2W-WSNLW-F; CLASS: IC; HEIGHT: 1.01MM; ROHS: Yes; MFG_PN01: MIMX8MN5CVPIZAA
*#7 = TitleBlock_MCPG: Page Create Date: March  8, 1995

## Sheet RAM_EMMC_Power.SchDoc
size A3; SheetNumber: 8; SheetTotal: 15
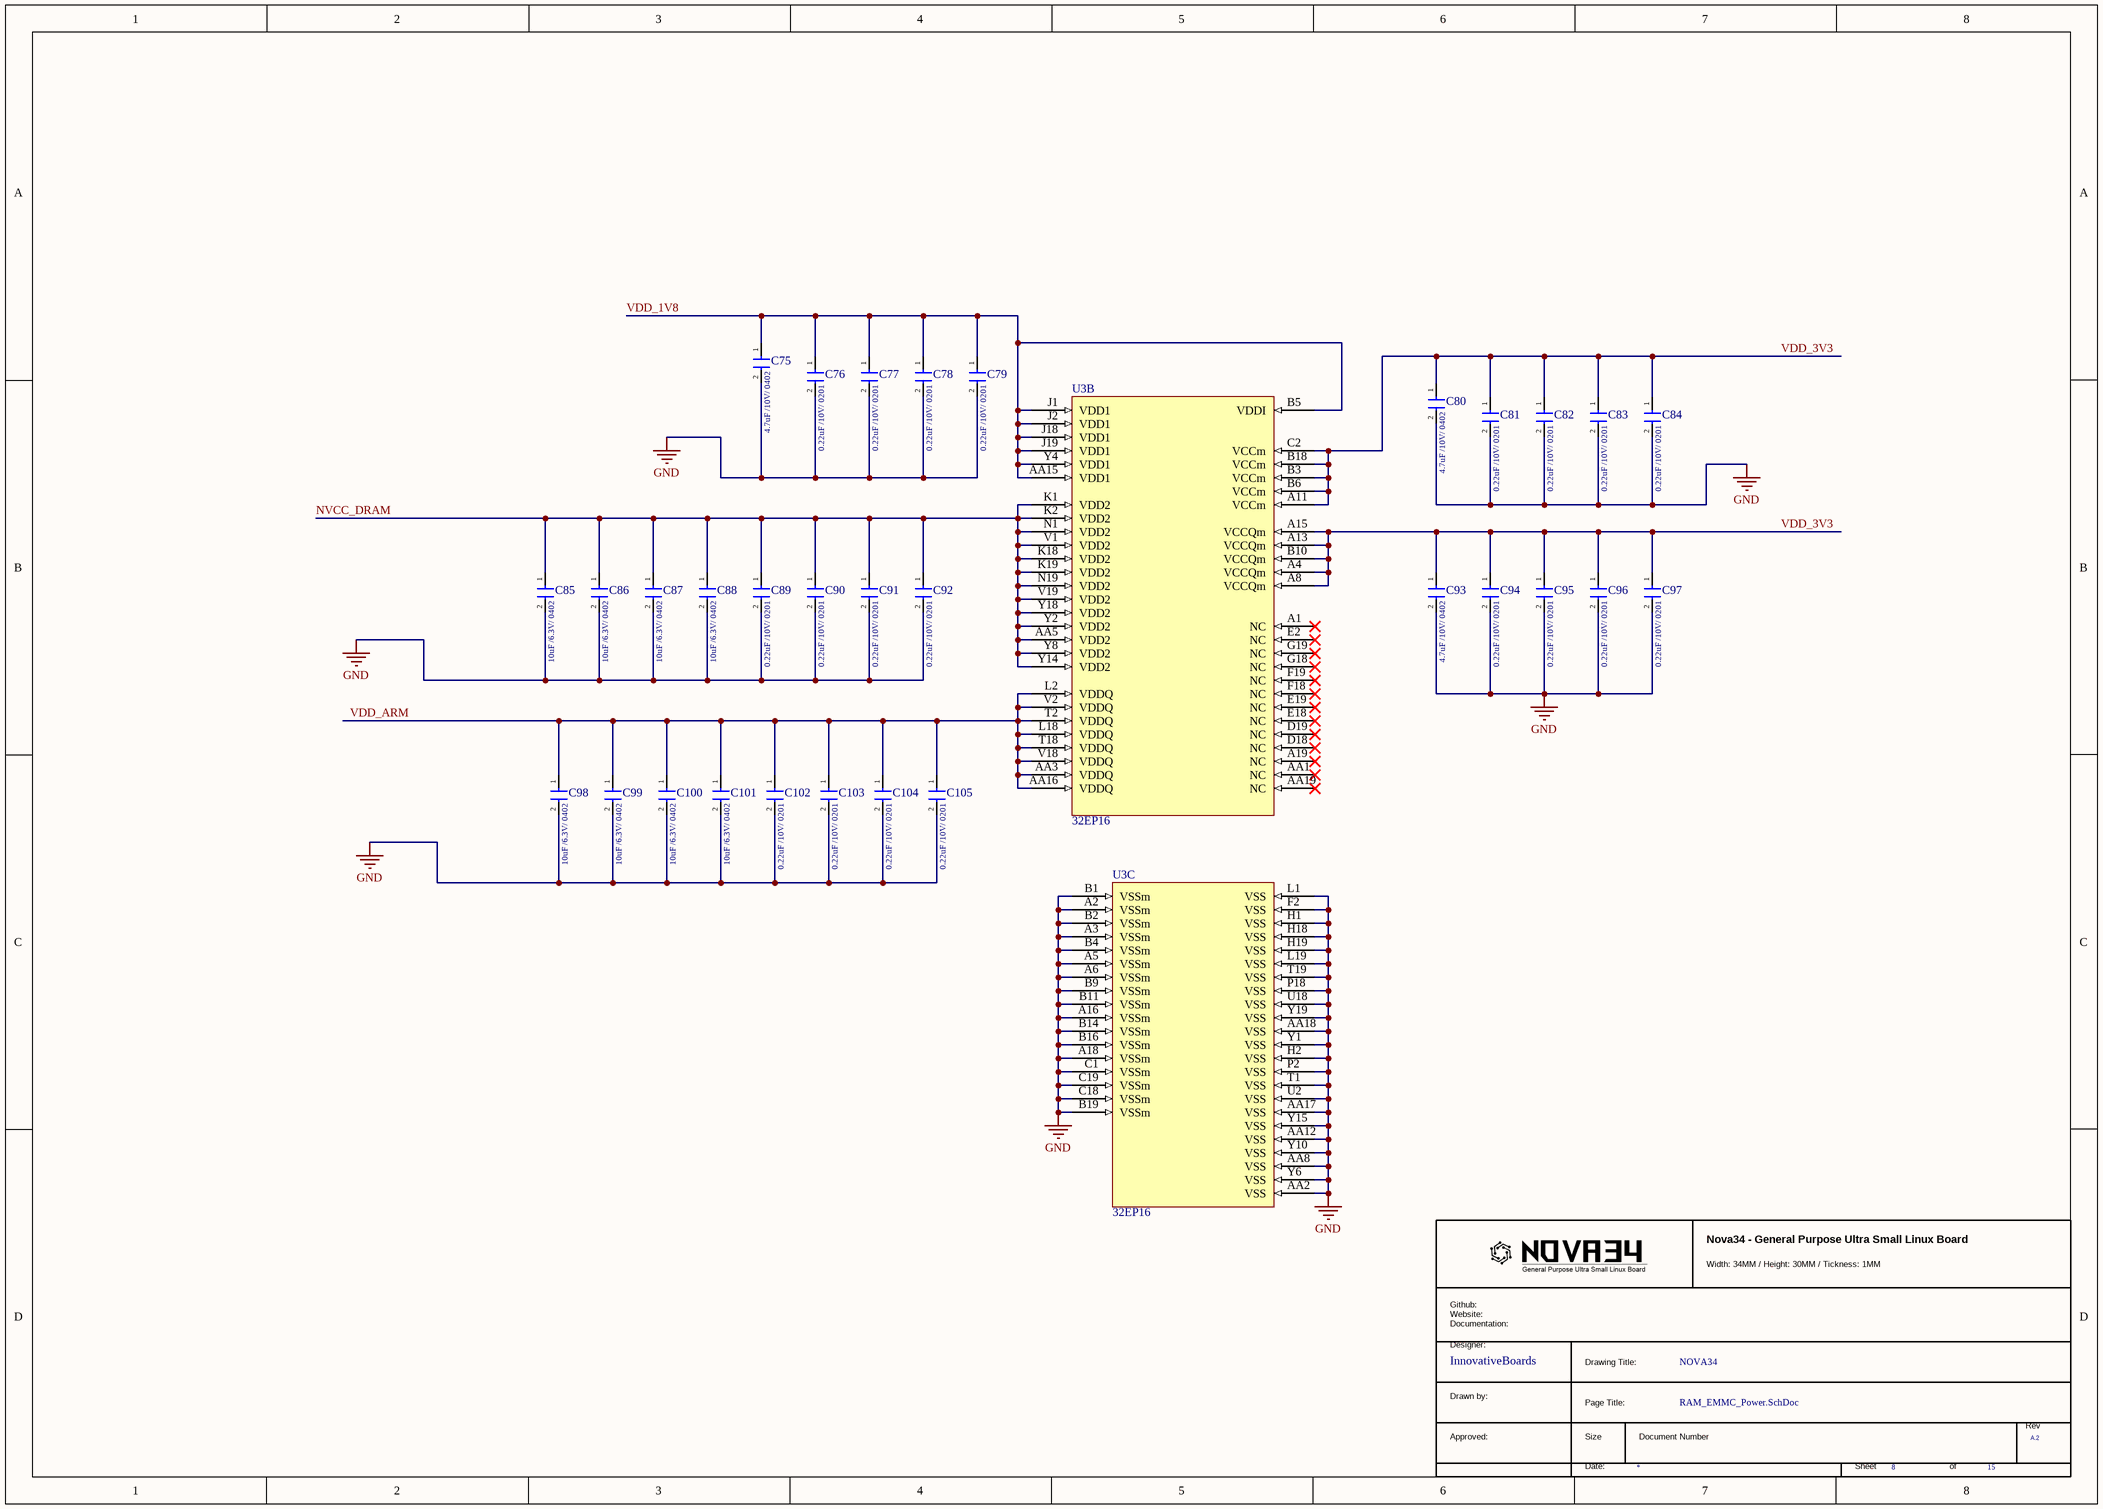
[diagram p7: RAM_EMMC_Power.SchDoc]

### Parts
(Parts that share a designator on the sheet are numbered #1, #2 ... from top to bottom, then left to right.)
*#8  RevCode: A.2  (hidden comment: TitleBlock_MCPG)  (graphical)
C75  4.7uF /10V/ 0402  [CAPC1005X70N]
C76  0.22uF /10V/ 0201  [GRM033D70J224ME01D]
C77  0.22uF /10V/ 0201  [GRM033D70J224ME01D]
C78  0.22uF /10V/ 0201  [GRM033D70J224ME01D]
C79  0.22uF /10V/ 0201  [GRM033D70J224ME01D]
C80  4.7uF /10V/ 0402  [CAPC1005X70N]
C81  0.22uF /10V/ 0201  [GRM033D70J224ME01D]
C82  0.22uF /10V/ 0201  [GRM033D70J224ME01D]
C83  0.22uF /10V/ 0201  [GRM033D70J224ME01D]
C84  0.22uF /10V/ 0201  [GRM033D70J224ME01D]
C85  10uF /6.3V/ 0402  [CAPC1005X65N]
C86  10uF /6.3V/ 0402  [CAPC1005X65N]
C87  10uF /6.3V/ 0402  [CAPC1005X65N]
C88  10uF /6.3V/ 0402  [CAPC1005X65N]
C89  0.22uF /10V/ 0201  [GRM033D70J224ME01D]
C90  0.22uF /10V/ 0201  [GRM033D70J224ME01D]
C91  0.22uF /10V/ 0201  [GRM033D70J224ME01D]
C92  0.22uF /10V/ 0201  [GRM033D70J224ME01D]
C93  4.7uF /10V/ 0402  [CAPC1005X70N]
C94  0.22uF /10V/ 0201  [GRM033D70J224ME01D]
C95  0.22uF /10V/ 0201  [GRM033D70J224ME01D]
C96  0.22uF /10V/ 0201  [GRM033D70J224ME01D]
C97  0.22uF /10V/ 0201  [GRM033D70J224ME01D]
C98  10uF /6.3V/ 0402  [CAPC1005X65N]
C99  10uF /6.3V/ 0402  [CAPC1005X65N]
C100  10uF /6.3V/ 0402  [CAPC1005X65N]
C101  10uF /6.3V/ 0402  [CAPC1005X65N]
C102  0.22uF /10V/ 0201  [GRM033D70J224ME01D]
C103  0.22uF /10V/ 0201  [GRM033D70J224ME01D]
C104  0.22uF /10V/ 0201  [GRM033D70J224ME01D]
C105  0.22uF /10V/ 0201  [GRM033D70J224ME01D]
U3  32EP16  [BGA144C40P19X21_800X950X80]  (parts B,C of 3)

### Nets
GND: C75.2 C76.2 C77.2 C78.2 C79.2 C80.2 C81.2 C82.2 C83.2 C84.2 C85.2 C86.2 C87.2 C88.2 C89.2 C90.2 C91.2 C92.2 C93.2 C94.2 C95.2 C96.2 C97.2 C98.2 C99.2 C100.2 C101.2 C102.2 C103.2 C104.2 C105.2 U3.A2(VSSm) U3.A3(VSSm) U3.A5(VSSm) U3.A6(VSSm) U3.A16(VSSm) U3.A18(VSSm) U3.AA2(VSS) U3.AA8(VSS) U3.AA12(VSS) U3.AA17(VSS) U3.AA18(VSS) U3.B1(VSSm) U3.B2(VSSm) U3.B4(VSSm) U3.B9(VSSm) U3.B11(VSSm) U3.B14(VSSm) U3.B16(VSSm) U3.B19(VSSm) U3.C1(VSSm) U3.C18(VSSm) U3.C19(VSSm) U3.F2(VSS) U3.H1(VSS) U3.H2(VSS) U3.H18(VSS) U3.H19(VSS) U3.L1(VSS) U3.L19(VSS) U3.P2(VSS) U3.P18(VSS) U3.T1(VSS) U3.T19(VSS) U3.U2(VSS) U3.U18(VSS) U3.Y1(VSS) U3.Y6(VSS) U3.Y10(VSS) U3.Y15(VSS) U3.Y19(VSS)
NVCC_DRAM: C85.1 C86.1 C87.1 C88.1 C89.1 C90.1 C91.1 C92.1 U3.AA5(VDD2) U3.K1(VDD2) U3.K2(VDD2) U3.K18(VDD2) U3.K19(VDD2) U3.N1(VDD2) U3.N19(VDD2) U3.V1(VDD2) U3.V19(VDD2) U3.Y2(VDD2) U3.Y8(VDD2) U3.Y14(VDD2) U3.Y18(VDD2)
VDD_1V8: C75.1 C76.1 C77.1 C78.1 C79.1 U3.AA15(VDD1) U3.B5(VDDI) U3.J1(VDD1) U3.J2(VDD1) U3.J18(VDD1) U3.J19(VDD1) U3.Y4(VDD1)
VDD_3V3: C80.1 C81.1 C82.1 C83.1 C84.1 C93.1 C94.1 C95.1 C96.1 C97.1 U3.A4(VCCQm) U3.A8(VCCQm) U3.A11(VCCm) U3.A13(VCCQm) U3.A15(VCCQm) U3.B3(VCCm) U3.B6(VCCm) U3.B10(VCCQm) U3.B18(VCCm) U3.C2(VCCm)
VDD_ARM: C98.1 C99.1 C100.1 C101.1 C102.1 C103.1 C104.1 C105.1 U3.AA3(VDDQ) U3.AA16(VDDQ) U3.L2(VDDQ) U3.L18(VDDQ) U3.T2(VDDQ) U3.T18(VDDQ) U3.V2(VDDQ) U3.V18(VDDQ)

Not connected (* = marked no-connect by the designer): U3 A1(NC)* A19(NC)* AA1(NC)* AA19(NC)* D18(NC)* D19(NC)* E2(NC)* E18(NC)* E19(NC)* F18(NC)* F19(NC)* G18(NC)* G19(NC)*

### Notes on the sheet
- (in symbol TitleBlock_MCPG) Nova34 - General Purpose Ultra Small Linux Board; Width: 34MM / Height: 30MM / Tickness: 1MM; Github: / Website: / Documentation:; Designer:; InnovativeBoards; Drawing Title:; NOVA34; Drawn by:; Page Title:; Rev; Approved:; Size; Document Number; Date:; Sheet; of

### Library data of the parts
C75 C80 C93 = GRT155C81A475ME13J: Multilayer Ceramic Capacitors MLCC - SMD/SMT 0402 X6S 4.7 F 20 10VDC AEC-Q200; Manufacturer_Name: Murata Electronics; Datasheet Link: https://search.murata.co.jp/Ceramy/image/img/A01X/G101/ENG/GRT155C81A475ME13-01A.pdf; Height: 0.7mm; Manufacturer_Part_Number: GRT155C81A475ME13J; Mouser Part Number: 81-GRT155C81A475ME3J; Mouser Price/Stock: https://www.mouser.co.uk/ProductDetail/Murata-Electronics/GRT155C81A475ME13J?qs=ufv2HEpFn%252BS%252BPUDm1eQCHw%3D%3D
C76-C79 C81-C84 C89-C92 C94-C97 C102-C105 = GRM033C81A224KE01J: Multilayer Ceramic Capacitors MLCC - SMD/SMT 0201 10VDC 0.22 F 10 X6S; Manufacturer_Name: Murata Electronics; Datasheet Link: https://search.murata.co.jp/Ceramy/image/img/A01X/G101/ENG/GRM033C81A224KE01-01A.pdf; Height: 0.33mm; Manufacturer_Part_Number: GRM033C81A224KE01J; Mouser Part Number: 81-GRM033C81A224KE1J; Mouser Price/Stock: https://www.mouser.co.uk/ProductDetail/Murata-Electronics/GRM033C81A224KE01J?qs=ufv2HEpFn%252BSIVjJJafvajA%3D%3D
C85-C88 C98-C101 = GRM155R60J106ME15D: Multilayer Ceramic Capacitors MLCC - SMD/SMT 10 uF 6.3 VDC 20% 0402 X5R; Manufacturer_Name: Murata Electronics; Datasheet Link: https://search.murata.co.jp/Ceramy/image/img/A01X/G101/ENG/GRM155R60J106ME15-01A.pdf; Height: 0.65mm; Manufacturer_Part_Number: GRM155R60J106ME15D; Mouser Part Number: 81-GRM155R60J106ME5D; Mouser Price/Stock: https://www.mouser.co.uk/ProductDetail/Murata-Electronics/GRM155R60J106ME15D?qs=I53XXhTNm8s65u6%252BR3mHqw%3D%3D; Arrow Part Number: GRM155R60J106ME15D; Arrow Price/Stock: https://www.arrow.com/en/products/grm155r60j106me15d/murata-manufacturing?region=nac
*#8 = TitleBlock_MCPG: Page Create Date: March  8, 1995

## Nets that join several sheets
GND: IMU-BMI160 (C112.2 C113.2 U6.6 U6.7), Display-ST0103A2W-WSNLW-F (6 pins), Speaker (IC1.3 IC1.11 IC1.15 IC1.17), Camera (CAM1.15 CAM1.24), RAM_EMMC_Power (71 pins)
BT_DEV_WAKE: Display-ST0103A2W-WSNLW-F (U1.Y8), Bluetooth-MX8M (U5.B8)
BT_HOST_WAKE: Display-ST0103A2W-WSNLW-F (U1.T8), Bluetooth-MX8M (U5.F9)
CAM_I2C_SCL: Bluetooth-MX8M (U1.B7), Camera (CAM1.5)
CAM_I2C_SDA: Bluetooth-MX8M (U1.A7), Camera (CAM1.3)
CAM_RST: Display-ST0103A2W-WSNLW-F (U1.V8), Camera (CAM1.6 R25.1)
IMU_SCL: IMU-BMI160 (R21.1 U6.13), Bluetooth-MX8M (U1.F10)
IMU_SDA: IMU-BMI160 (R22.1 U6.14), Bluetooth-MX8M (U1.D8)
VDD_1V8: Camera (CAM1.10 CAM1.11), RAM_EMMC_Power (12 pins)
VDD_3V3: IMU-BMI160 (8 pins), Display-ST0103A2W-WSNLW-F (6 pins), Speaker (IC1.7 IC1.8), Camera (R25.2), RAM_EMMC_Power (20 pins)